# Altium project ESP32SSMB V1.4 .PrjPcb
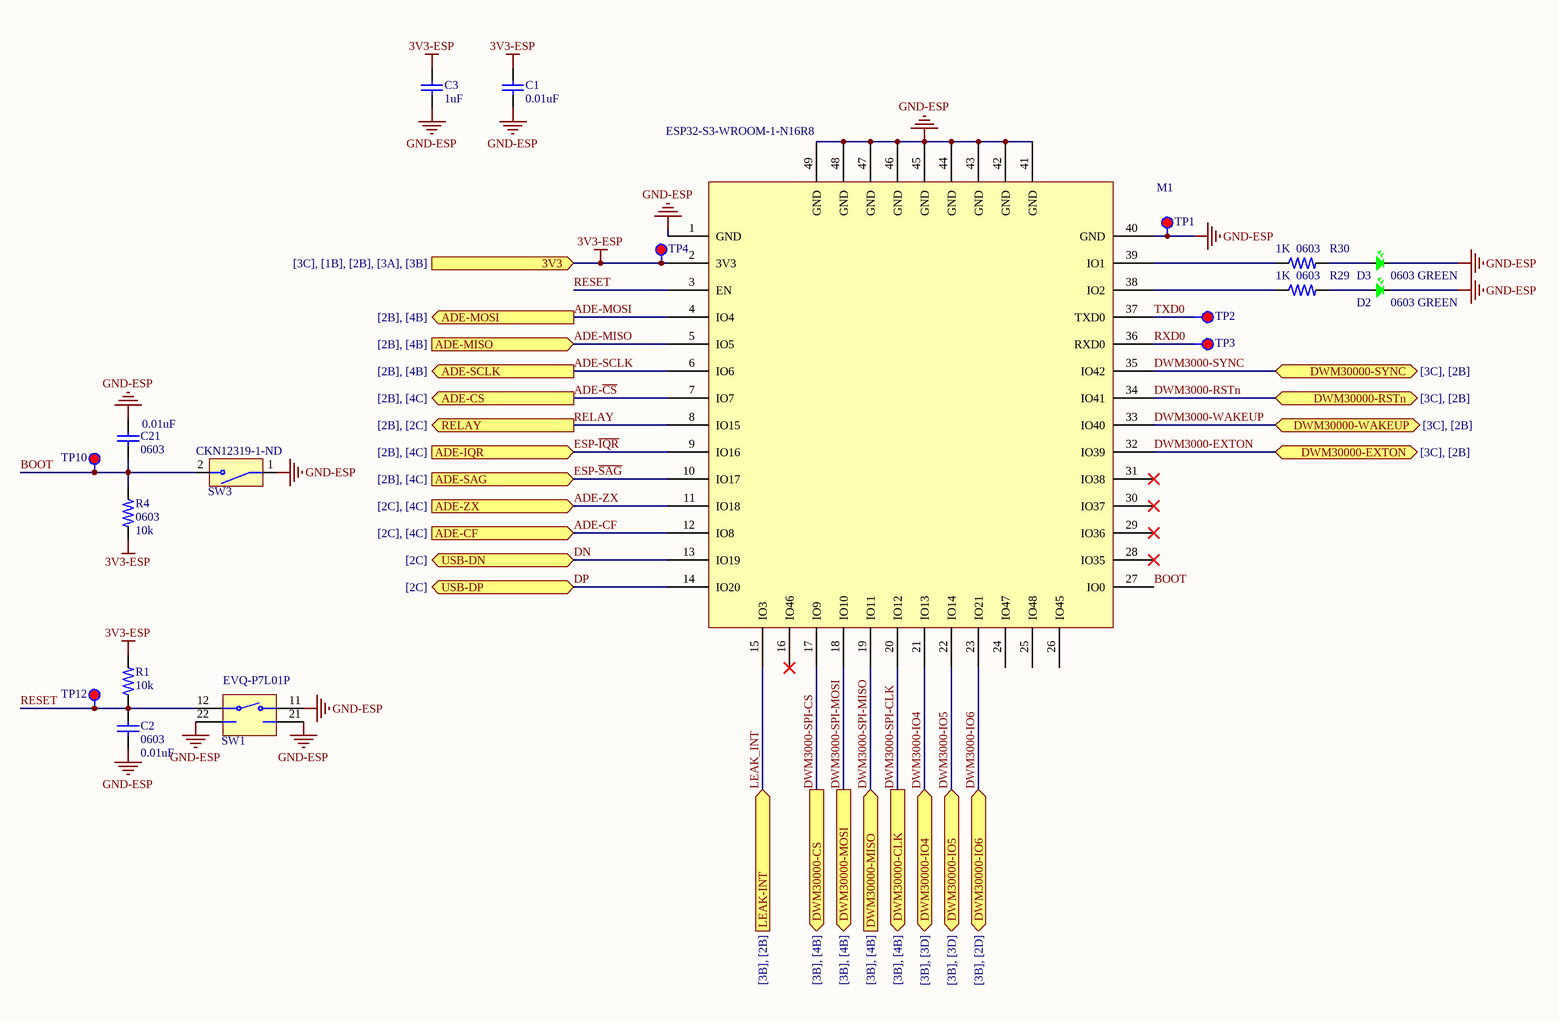
[diagram p0: ESP32.SchDoc]
2 sheets, 21 parts. Net scope: flat (ports and power ports of the same name join across sheets).
Board file: ESP32SSMB V1.4 .PcbDoc
Sheets:
  ESP32.SchDoc
  Power.SchDoc

## Sheet ESP32.SchDoc: ESP32 S3 Schematic
size A3; ApprovedBy: TVBac; SheetNumber: 2; SheetTotal: 6

### Parts
C1  value 0.01uF  [SMD-CAP-0603-YAGEO]  (hidden comment: 0.1 µF ±10% 10V Ceramic Capacitor X7R 0603 (1608 Metric))
C2  value 0.01uF  Package: 0603  [SMD-CAP-0603-YAGEO]  (hidden comment: 10000 pF ±10% 16V Ceramic Capacitor X7R 0603 (1608 Metric))
C3  value 1uF  [SMD-CAP-0603-YAGEO]  (hidden comment: 1 µF ±10% 16V Ceramic Capacitor X7R 0603 (1608 Metric))
C21  value 0.01uF  Package: 0603  [SMD-CAP-0603-YAGEO]  (hidden comment: 10000 pF ±10% 16V Ceramic Capacitor X7R 0603 (1608 Metric))
D2  0603 GREEN  [LED0603_GREEN]
D3  0603 GREEN  [LED0603_GREEN]
M1  Manufacturer Part Number: ESP32-S3-WROOM-1-N16R8  [MODULE-ESP32-S3-WROOM-1-N16R8]  (hidden comment: Bluetooth, WiFi 802.11b/g/n, Bluetooth v4.2 +EDR Transceiver Module 2.4GHz ~ 2.5GHz PCB Trace Surface Mount)
R1  value 10k  [SMD-RES-0603-SEI]  (hidden comment: 10 kOhms ±1% 0.25W, 1/4W Chip Resistor 0603 (1608 Metric) Automotive AEC-Q200, Pulse Withstanding Thick Film)
R4  value 10k  Package: 0603  [SMD-RES-0603-SEI]  (hidden comment: 10 kOhms ±1% 0.25W, 1/4W Chip Resistor 0603 (1608 Metric) Automotive AEC-Q200, Pulse Withstanding Thick Film)
R29  value 1K  Package: 0603  [SMD-RES-0603-SEI]  (hidden comment: 1 kOhms ±1% 0.25W, 1/4W Chip Resistor 0603 (1608 Metric) Automotive AEC-Q200, Pulse Withstanding Thick Film)
R30  value 1K  Package: 0603  [SMD-RES-0603-SEI]  (hidden comment: 1 kOhms ±1% 0.25W, 1/4W Chip Resistor 0603 (1608 Metric) Automotive AEC-Q200, Pulse Withstanding Thick Film)
SW1  MP: EVQ-P7L01P  [SW-HxLxW-1.1x3.5x2.9-PEC]  (hidden comment: https://www.digikey.com/en/products/detail/panasonic-electronic-components/EVQ-P7L01P/4429453)
SW3  Supplier Part Number: CKN12319-1-ND  [SW-HxLxW-5.0x6.0x3.5-C&K]  (hidden comment: Tactile Switch SPST-NO Top Actuated Surface Mount)
TP1  Test Point  [TEST_POINT]  (value not drawn)
TP2  Test Point  [TEST_POINT]  (value not drawn)
TP3  Test Point  [TEST_POINT]  (value not drawn)
TP4  Test Point  [TEST_POINT]  (value not drawn)
TP10  Test Point  [TEST_POINT]  (value not drawn)
TP12  Test Point  [TEST_POINT]  (value not drawn)

### Ports
3V3 (in, see [3C], [1B], [2B], [3A], [3B]), ADE-CF (in, see [2C], [4C]), ADE-CS (out, see [2B], [4C]), ADE-IQR (in, see [2B], [4C]), ADE-MISO (in, see [2B], [4B]), ADE-MOSI (out, see [2B], [4B]), ADE-SAG (in, see [2B], [4C]), ADE-SCLK (out, see [2B], [4B]), ADE-ZX (in, see [2C], [4C]), DWM30000-CLK (out, see [3B], [4B]), DWM30000-CS (out, see [3B], [4B]), DWM30000-EXTON (bidir, see [3C], [2B]), DWM30000-IO4 (bidir, see [3B], [3D]), DWM30000-IO5 (bidir, see [3B], [3D]), DWM30000-IO6 (bidir, see [3B], [2D]), DWM30000-MISO (in, see [3B], [4B]), DWM30000-MOSI (out, see [3B], [4B]), DWM30000-RSTn (bidir, see [3C], [2B]), DWM30000-SYNC (bidir, see [3C], [2B]), DWM30000-WAKEUP (bidir, see [3C], [2B]), LEAK-INT (in, see [3B], [2B]), RELAY (out, see [2B], [2C]), USB-DN (bidir, see [2C]), USB-DP (bidir, see [2C])

### Nets
3V3-ESP: C1.2 C3.2 M1.2(3V3) R1.2 R4.2 TP4.1 ; port 3V3
GND-ESP: C1.1 C2.1 C3.1 C21.1 D2.2 D3.2 M1.1(GND) M1.40(GND) M1.41(GND) M1.42(GND) M1.43(GND) M1.44(GND) M1.45(GND) M1.46(GND) M1.47(GND) M1.48(GND) M1.49(GND) SW1.11 SW1.21 SW1.22 SW3.1(COM) TP1.1
ADE-~{CS}: M1.7(IO7) ; port ADE-CS
ADE-CF: M1.12(IO8) ; port ADE-CF
ADE-MISO: M1.5(IO5) ; port ADE-MISO
ADE-MOSI: M1.4(IO4) ; port ADE-MOSI
ADE-SCLK: M1.6(IO6) ; port ADE-SCLK
ADE-ZX: M1.11(IO18) ; port ADE-ZX
BOOT: C21.2 M1.27(IO0) R4.1 SW3.2(NO) TP10.1
DN: M1.13(IO19) ; port USB-DN
DP: M1.14(IO20) ; port USB-DP
DWM3000-EXTON: M1.32(IO39) ; port DWM30000-EXTON
DWM3000-IO4: M1.21(IO13) ; port DWM30000-IO4
DWM3000-IO5: M1.22(IO14) ; port DWM30000-IO5
DWM3000-IO6: M1.23(IO21) ; port DWM30000-IO6
DWM3000-RSTn: M1.34(IO41) ; port DWM30000-RSTn
DWM3000-SPI-CLK: M1.20(IO12) ; port DWM30000-CLK
DWM3000-SPI-CS: M1.17(IO9) ; port DWM30000-CS
DWM3000-SPI-MISO: M1.19(IO11) ; port DWM30000-MISO
DWM3000-SPI-MOSI: M1.18(IO10) ; port DWM30000-MOSI
DWM3000-SYNC: M1.35(IO42) ; port DWM30000-SYNC
DWM3000-WAKEUP: M1.33(IO40) ; port DWM30000-WAKEUP
ESP-~{IQR}: M1.9(IO16) ; port ADE-IQR
ESP-~{SAG}: M1.10(IO17) ; port ADE-SAG
LEAK_INT: M1.15(IO3) ; port LEAK-INT
RELAY: M1.8(IO15) ; port RELAY
RESET: C2.2 M1.3(EN) R1.1 SW1.12 TP12.1
RXD0: M1.36(RXD0) TP3.1
TXD0: M1.37(TXD0) TP2.1
NetD2_1: D2.1 R29.2
NetD3_1: D3.1 R30.2
NetM1_38: M1.38(IO2) R29.1
NetM1_39: M1.39(IO1) R30.1

Not connected (* = marked no-connect by the designer): M1 16(IO46)* 24(IO47) 25(IO48) 26(IO45) 28(IO35)* 29(IO36)* 30(IO37)* 31(IO38)*

### Library data of the parts
C1 = CAP; 0.1uF; 10V; 0603; SMD; CC0603KRX7R6BB104: Multilayer Ceramic Capacitor, 0.1 uF, 10 V, ± 10%, X7R, 0603 [1608 Metric]; Manufacturer: Yageo; Material: 4241ConductorMaterial; Designer: TVBac; Supplier: Digikey; Supplier Part Number: 311-4055-1-ND; Manufacturer Part Number: CC0603KRX7R6BB104; RoHS: Yes; Category: Ceramic Capacitors; Stock: 113177; Pricing: 1=0.1, 10=0.067, 50=0.0398, 100=0.0314, 500=0.02316, 1000=0.01918, 4000=0.01633, 8000=0.01519, 12000=0.01443, 28000=0.01367, 100000=0.01035, 200000=0.0101, 400000=0.00949 (USD); Lead Free: 5697LeadFree; Halogen Free: 5694HalogenFree; ComponentLink1URL: https://datasheet.ciiva.com/11586/upy-gphc-x7r-6-3v-to-50v-8-11586327.pdf?src-supplier=Avnet; ComponentLink1Description: https://datasheet.ciiva.com/11586/upy-gphc-x7r-6-3v-to-50v-8-11586327.pdf?src-supplier=Avnet; ComponentLink2Description: Link Digikey; ComponentLink2URL: https://www.digikey.com/en/products/detail/yageo/CC0603KRX7R6BB104/5883741
C2 C21 = CAP; 0.01uF; 16V; 0603; SMD; CC0603KRX7R7BB103: Multilayer Ceramic Capacitor, 0.01 uF, 16 V, ± 10%, X7R, 0603 [1608 Metric]; Manufacturer: Yageo; Material: 4241ConductorMaterial; Designer: TVBac; Supplier: Digikey; Supplier Part Number: 311-3369-1-ND; Manufacturer Part Number: CC0603KRX7R7BB103; RoHS: Yes; Category: Ceramic Capacitors; Stock: 24661; Pricing: 1=0.1, 10=0.041, 50=0.0236, 100=0.0183, 500=0.01378, 1000=0.01083 (USD); Lead Free: 5697LeadFree; ComponentLink1URL: https://datasheet.ciiva.com/7978/1489800-7978139.pdf?src-supplier=Element14; ComponentLink1Description: https://datasheet.ciiva.com/7978/1489800-7978139.pdf?src-supplier=Element14; ComponentLink2Description: Link Digikey; ComponentLink2URL: https://www.digikey.com/en/products/detail/yageo/CC0603KRX7R7BB103/5883753
C3 = CAP; 1uF; 16V; 0603; SMD; CC0603KRX7R7BB105: 0603 1 uF 16 V ±10 % Tolerance X7R SMT Multilayer Ceramic Capacitor; Manufacturer: Yageo; Material: 4241ConductorMaterial; Dissipation Factor: 5%; Designer: TVBac; Supplier: Digikey; Supplier Part Number: 311-1446-1-ND; Manufacturer Part Number: CC0603KRX7R7BB105; RoHS: Yes; Category: Ceramic Capacitors; Stock: 9165861; Pricing: 1=0.1, 10=0.066, 50=0.0392, 100=0.0308, 500=0.02274, 1000=0.01882, 4000=0.01785, 8000=0.01626, 12000=0.01545, 20000=0.01456, 28000=0.01404, 40000=0.01353, 100000=0.01313 (USD); Mounting Technology: Surface Mount; Case/Package: 0603; Pins: 2; Case Code (Metric): 1608; Case Code (Imperial): 0603; Min Operating Temperature: -55°C; Max Operating Temperature: 125°C; Tolerance: 10%; Voltage Rating: 16V; Package Quantity: 1; Packaging: Tape and Reel; Voltage Rating (DC): 16V; Dielectric: X7R; Termination: SMD/SMT; Voltage: 16V; Series: CC; Construction: Flat; Length: 1.6mm; Width: 0.031inch; Height: 0.8mm; Thickness: 0.035inch; Depth: 0.8mm; Radiation Hardening: No; RoHS Compliant: Yes; Reach SVHC Compliant: Unknown; Lead Free: 5697LeadFree; Halogen Free: 5694HalogenFree; ComponentLink1URL: https://datasheet.ciiva.com/8033/1734573-8033801.pdf?src-supplier=Element14; ComponentLink1Description: https://datasheet.ciiva.com/8033/1734573-8033801.pdf?src-supplier=Element14; ComponentLink2URL: https://datasheet.ciiva.com/8033/1734573-8033800.pdf?src-supplier=Element14; ComponentLink2Description: https://datasheet.ciiva.com/8033/1734573-8033800.pdf?src-supplier=Element14; ComponentLink3URL: https://datasheet.ciiva.com/7978/1489800-7978143.pdf?src-supplier=Element14; ComponentLink3Description: https://datasheet.ciiva.com/7978/1489800-7978143.pdf?src-supplier=Element14; ComponentLink4URL: https://datasheet.ciiva.com/28450/1489800-28450557.pdf?src-supplier=Element14; ComponentLink4Description: https://datasheet.ciiva.com/28450/1489800-28450557.pdf?src-supplier=Element14; ComponentLink5URL: https://datasheet.ciiva.com/176/mlccorderingcode-176789.pdf?src-supplier=Digikey; ComponentLink5Description: https://datasheet.ciiva.com/176/mlccorderingcode-176789.pdf?src-supplier=Digikey; ComponentLink6URL: https://datasheet.ciiva.com/176/mlccorderingcode-176788.pdf?src-supplier=Digikey; ComponentLink6Description: https://datasheet.ciiva.com/176/mlccorderingcode-176788.pdf?src-supplier=Digikey; ComponentLink7URL: https://datasheet.ciiva.com/176/mlccorderingcode-176790.pdf?src-supplier=Digikey; ComponentLink7Description: https://datasheet.ciiva.com/176/mlccorderingcode-176790.pdf?src-supplier=Digikey; ComponentLink8URL: https://datasheet.ciiva.com/5425/upy-gphc-x7r-6-3v-to-50v-8-12304-5425495.pdf?src-supplier=Mouser; ComponentLink8Description: https://datasheet.ciiva.com/5425/upy-gphc-x7r-6-3v-to-50v-8-12304-5425495.pdf?src-supplier=Mouser; ComponentLink9Description: Link Digikey; ComponentLink9URL: https://www.digikey.com/en/products/detail/yageo/CC0603KRX7R7BB105/2833611?s=N4IgTCBcDaIMJwAwDZEGYDSAlAGgdizwCEiBGRAVhAF0BfIA
D2 D3 = L0603_GREEN: 225mcd~450mcd Colorless Transparent Lens -40℃~+85℃ Positive Stick 520nm~535nm Green 120° 70mW 2.4V~3V 0603 LED Indication - Discrete ROHS; Manufacturer: Amicc; Manufacture Part Number: A-SP192DGHC-C01-4T; Packaging: Cut Tape (CT); Link: https://www.lcsc.com/product-detail/LED-Indication-Discrete_Amicc-A-SP192DGHC-C01-4T_C19171301.html?s_z=n_LED%200603%20green; Package: 0603
M1 = ESP32-S3-WROOM-1-N16R8; SMD;: SMD mod, ESP32-S3R8 with 3.3V, 8MB Octal PSRAM die insid, 6MBQuad SPI flash, pcb ant; Manufacturer: Espressif Systems; Designer: TVBac; Supplier: Digikey; Supplier Part Number: 1965-ESP32-S3-WROOM-1-N16R8CT-ND; RoHS: No; Category: LDO; Stock: 8003; Pricing: 1=3.9 (USD); ComponentLink1Description: Link Digikey; ComponentLink1URL: https://www.digikey.com/en/products/detail/espressif-systems/ESP32-S3-WROOM-1-N16R8/16162642
R1 R4 = RES; 10K; 0603; SMD; ESR03EZPF1002: SMD Chip Resistor, 10 kOhm, ± 1%, 250 mW, 0603 [1608 Metric], Thick Film, Anti-Surge; Manufacturer: Rohm; Power Rating: 250mW; Temperature Coefficient: 100ppm/°C; Voltage Rating (DC): 150V; Designer: TVBac; Supplier: Digikey; Supplier Part Number: RHM10KADCT-ND; Manufacturer Part Number: ESR03EZPF1002; RoHS: Yes; Category: Chip SMD Resistors; Stock: 2136779; Pricing: 1=0.16, 10=0.078, 50=0.0516, 100=0.044, 500=0.03138, 1000=0.02764 (USD); Case/Package: 0603; Case Code (Metric): 1608; Case Code (Imperial): 0603; Min Operating Temperature: -55°C; Max Operating Temperature: 155°C; Tolerance: 1%; Package Quantity: 1; Packaging: Cut Tape; Number of Terminations: 2; Max Power Dissipation: 250mW; Features: Automotive AEC-Q200; Series: ESR; Length: 0.063inch; Width: 0.031inch; Height: 0.022inch; Ratings: AEC-Q200; RoHS Compliant: Yes; Lead Free: 5697LeadFree; ComponentLink1URL: https://datasheet.ciiva.com/2469/esr-2469710.pdf?src-supplier=Digikey; ComponentLink1Description: https://datasheet.ciiva.com/2469/esr-2469710.pdf?src-supplier=Digikey; ComponentLink2URL: https://datasheet.ciiva.com/2469/esr-2469711.pdf?src-supplier=Digikey; ComponentLink2Description: https://datasheet.ciiva.com/2469/esr-2469711.pdf?src-supplier=Digikey; ComponentLink3URL: https://datasheet.ciiva.com/2469/esr-2469709.pdf?src-supplier=Digikey; ComponentLink3Description: https://datasheet.ciiva.com/2469/esr-2469709.pdf?src-supplier=Digikey; ComponentLink4Description: Link Digikey; ComponentLink4URL: https://www.digikey.com/en/products/detail/rohm-semiconductor/ESR03EZPF1002/1983429
R29 R30 = RES; 1K; 0603; SMD; ESR03EZPF1001: SMD Chip Resistor, 1 kOhm, ± 1%, 250 mW, 0603 [1608 Metric], Thick Film, Anti-Surge; Manufacturer: Rohm; Voltage Rating: 150V; Designer: TVBac; Supplier: Digikey; Supplier Part Number: RHM1.00KADCT-ND; Manufacturer Part Number: ESR03EZPF1001; RoHS: Yes; Category: Chip SMD Resistors; Stock: 2703233; Pricing: 1=0.11, 10=0.055, 50=0.0364, 100=0.0309, 500=0.02206, 1000=0.01943 (USD); Voltage Rating (DC): 150V; Lead Free: 5697LeadFree; ComponentLink1URL: https://datasheet.ciiva.com/2469/esr-2469712.pdf?src-supplier=Digikey; ComponentLink1Description: https://datasheet.ciiva.com/2469/esr-2469712.pdf?src-supplier=Digikey; ComponentLink2URL: https://datasheet.ciiva.com/2469/esr-2469713.pdf?src-supplier=Digikey; ComponentLink2Description: https://datasheet.ciiva.com/2469/esr-2469713.pdf?src-supplier=Digikey; ComponentLink3URL: https://datasheet.ciiva.com/2469/esr-2469714.pdf?src-supplier=Digikey; ComponentLink3Description: https://datasheet.ciiva.com/2469/esr-2469714.pdf?src-supplier=Digikey; ComponentLink4Description: Link Digikey; ComponentLink4URL: https://www.digikey.com/en/products/detail/rohm-semiconductor/ESR03EZPF1001/1983428
SW1 = BUT; SW; SMD; EVQ-P7L01P: Tactile Switch SPST-NO Side Actuated Surface Mount, Right Angle; MF: Panasonic Electronic Components; SnapEDA_Link: https://www.snapeda.com/parts/EVQ-P7L01P/Panasonic+Electronic+Components/view-part/?ref=snap; Package: None; Check_prices: https://www.snapeda.com/parts/EVQ-P7L01P/Panasonic+Electronic+Components/view-part/?ref=eda; Purchase-URL: https://pricing.snapeda.com/search/part/EVQ-P7L01P/?ref=eda; Digi-Key_Part_Number: P16769TR-ND; Value: *
SW3 = BUT; SW; SMD; PTS636SM50JSMTRLFS: Switch Tactile N.O. SPST Rectangular Button J-Bend 0.05A 12VDC 1.77N SMD T/R; Manufacturer: ITT C&K; Contact Resistance: 100mR; Number of Positions: 2NUMBER; Supplier: Digikey; Manufacturer Part Number: PTS636SM50JSMTRLFS; RoHS: No; Category: Tactile Switches; Stock: 80725; Pricing: 1=0.21, 10=0.199, 25=0.1888, 100=0.1717, 250=0.1614, 500=0.14766 (USD); ComponentLink1Description: Link Digikey; ComponentLink1URL: https://www.digikey.com/en/products/detail/c-k/PTS636-SM50J-SMTR-LFS/10071732
TP1-TP4 TP10 TP12 = TEST_POINT

## Sheet Power.SchDoc
size A4; SheetNumber: 5; SheetTotal: 6
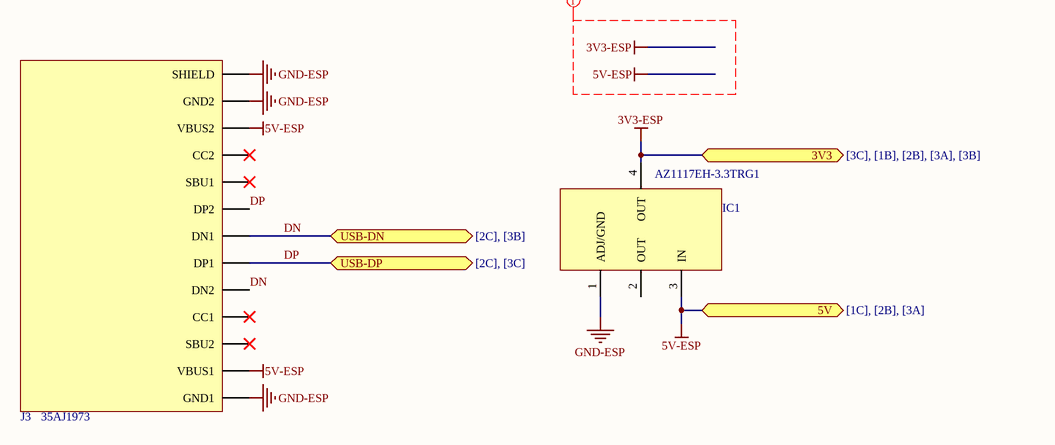
[diagram p1: Power.SchDoc]

### Parts
IC1  MP: AZ1117EH-3.3TRG1  [SOT-223-3-DI]  (hidden comment: Linear Voltage Regulator IC Positive Fixed 1 Output 1A SOT-223-3)
J3  Supplier Part Number: 35AJ1973  [TYPE-C-HOR-RECEPTACLE-24PIN-MOLEX]  (hidden comment: USB-C (USB TYPE-C) USB 2.0 Receptacle Connector 24 (16+8 Dummy) Position Surface Mount, Right Angle; Through Hole)

### Ports
3V3 (bidir, see [3C], [1B], [2B], [3A], [3B]), 5V (bidir, see [1C], [2B], [3A]), USB-DN (bidir, see [2C], [3B]), USB-DP (bidir, see [2C], [3C])

### Nets
3V3-ESP: IC1.4(OUT) ; port 3V3
5V-ESP: IC1.3(IN) J3.A4B9(VBUS1) J3.B4A9(VBUS2) ; port 5V
GND-ESP: IC1.1(ADJ/GND) J3.A1B12(GND1) J3.B1A12(GND2) J3.SHIELD
DN: J3.A7(DN1) J3.B7(DN2) ; port USB-DN
DP: J3.A6(DP1) J3.B6(DP2) ; port USB-DP

Not connected (* = marked no-connect by the designer): IC1 2(OUT); J3 A5(CC1)* A8(SBU1)* B5(CC2)* B8(SBU2)*

### Layout directives
net class POWER: 3V3-ESP, 5V-ESP

### Library data of the parts
IC1 = LDO; 3V3; 1A; SMD; AZ1117EH-3.3TRG1: Linear Voltage Regulator IC 1 Output 1A SOT-223; MF: Diodes Inc.; Designer: TVBac; Package: SOT-223 Diodes Inc.; Value: *; Price: None; SnapEDA_Link: https://www.snapeda.com/parts/AZ1117EH-3.3TRG1/Diodes%20Inc./view-part/482930/?ref=snap; Availability: Unavailable; ComponentLink1Description: Link Digikey; ComponentLink1URL: https://www.digikey.com/en/products/detail/diodes-incorporated/AZ1117EH-3-3TRG1/5001329
J3 = Type-C; USB; HOR; RECEPTACLE;  24PIN; 217179-0001: USB Connector, 16 Contact(s), Female, Right Angle, Surface Mount Terminal, Locking, Receptacle; Manufacturer: Molex; USB Standard: USB 2.0; Current Rating: 1.25A; Number of Contacts: 16; Voltage Rating: 30V; Designer: TVBac; Supplier: Avnet; Manufacturer Part Number: 217179-0001; RoHS: No; Category: Connectors; Stock: 7200; Pricing: 1=1.02, 25=0.853, 100=0.722, 250=0.677, 500=0.631 (USD); Contact Material: Nickel,Gold; Min Operating Temperature: -40°C; Max Operating Temperature: 85°C; Gender: Receptacle; Height: 3.36mm; ComponentLink1Description: Link Digikey; ComponentLink1URL: https://www.digikey.com/en/products/detail/molex/2171790001/13913749

## Nets that join several sheets
3V3-ESP: ESP32 (6 pins), Power (IC1.4)
GND-ESP: ESP32 (22 pins), Power (IC1.1 J3.A1B12 J3.B1A12 J3.SHIELD)
DN: ESP32 (M1.13), Power (J3.A7 J3.B7)
DP: ESP32 (M1.14), Power (J3.A6 J3.B6)